# EAGLE schematic slave-basic (EAGLE 8.4.0)
DELETE: MF
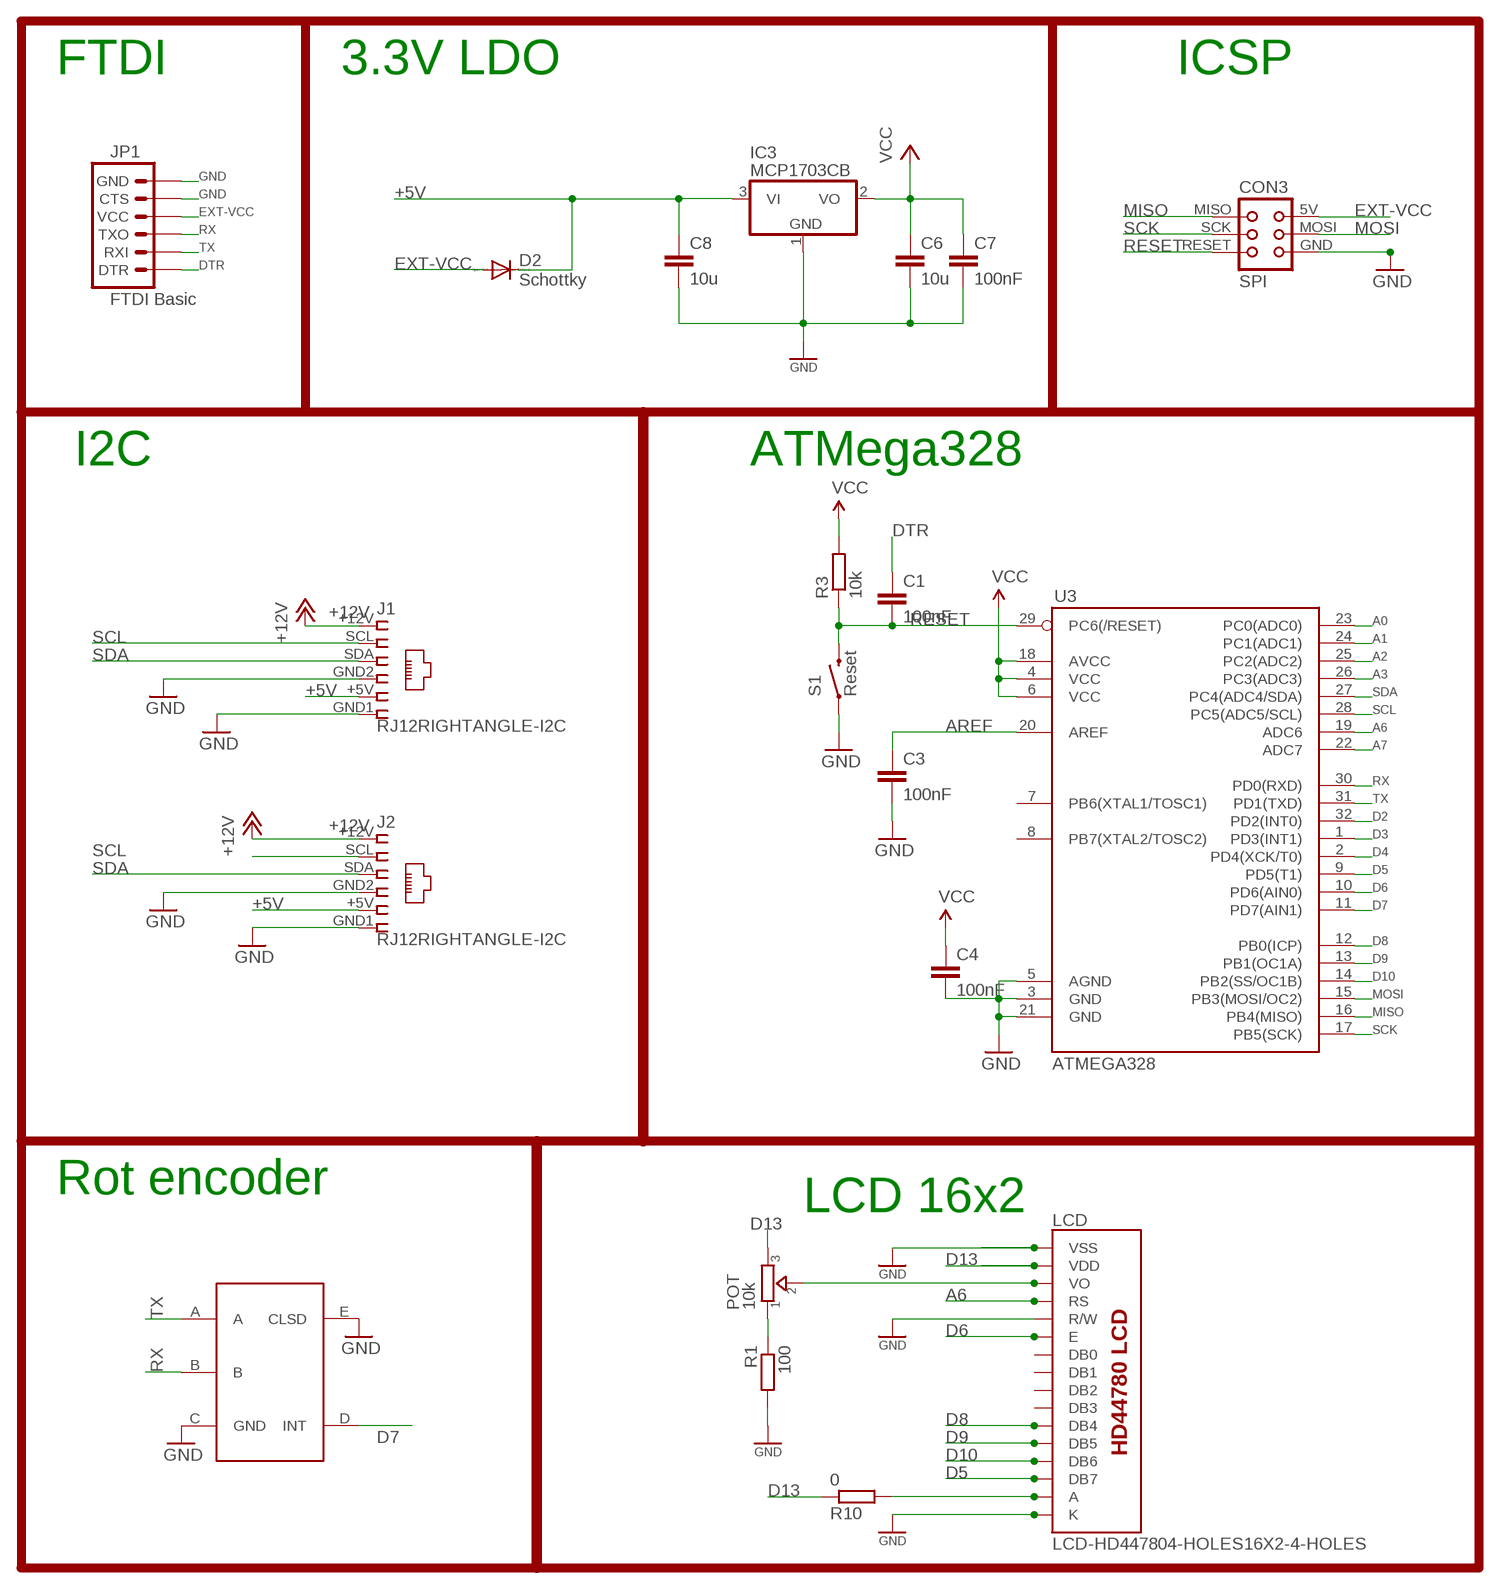
[diagram p0: schematic, sheet 1]

## Parts
C1  100nF  C-EUC0805K  [C0805K]
C3  100nF  C-EUC0805K  [C0805K]
C4  100nF  C-EUC0805K  [C0805K]
C6  10u  C-EUC0805K  [C0805K]
C7  100nF  C-EUC0805K  [C0805K]
C8  10u  C-EUC0805K  [C0805K]
CON3  SPI  TINYISPTAG  [TC2030-MCP]
D2  Schottky  MBR0520LT  [SOD123]
IC3  MCP1703CB  [SOT23]
J1  RJ12RIGHTANGLE-I2C  [RJ12-RIGHTANGLE-I2C]
J2  RJ12RIGHTANGLE-I2C  [RJ12-RIGHTANGLE-I2C]
JP1  FTDI Basic  ARDUINO_SERIAL_PROGRAMPTH  [1X06]
LCD  LCD-HD447804-HOLES16X2-4-HOLES  [LCD-16X2-4HOLES]
POT  10k  TRIMMER-3362P  [TRIMMER_3362P]
R1  100  R-EU_R0805  [R0805]
R3  10k  R-EU_R0805  [R0805]
R10  0  R-EU_R0805  [R0805]
S1  Reset  SWITCH-MOMENTARY-2SMD-ALT01  [TACTILE-SWITCH-SMD-ALT01]
U3  ATMEGA328  ATMEGA168  [TQFP32-08]
U$1  EC11E  [EC11E]

## Nets
+5V: C8.1 D2.C IC3.3(VI) J1.+5V J2.+5V
+12V [power]: J1.+12V J2.+12V
A0: U3.23(PC0(ADC0))
A1: U3.24(PC1(ADC1))
A2: U3.25(PC2(ADC2))
A3: U3.26(PC3(ADC3))
A6: LCD.4(RS) U3.19(ADC6)
A7: U3.22(ADC7)
AREF: C3.1 U3.20(AREF)
D2: U3.32(PD2(INT0))
D3: U3.1(PD3(INT1))
D4: U3.2(PD4(XCK/T0))
D5: LCD.14(DB7) U3.9(PD5(T1))
D6: LCD.6(E) U3.10(PD6(AIN0))
D7: U3.11(PD7(AIN1)) U$1.D(INT)
D8: LCD.11(DB4) U3.12(PB0(ICP))
D9: LCD.12(DB5) U3.13(PB1(OC1A))
D10: LCD.13(DB6) U3.14(PB2(SS/OC1B))
D13: LCD.2(VDD) POT.3 R10.1
DTR: C1.1 JP1.1(DTR)
EXT-VCC: CON3.5V(VCC) D2.A JP1.4(VCC)
GND [power]: C3.2 C4.2 C6.2 C7.2 C8.2 CON3.GND IC3.1(GND) J1.GND1 J1.GND2 J2.GND1 J2.GND2 JP1.5(CTS) JP1.6(GND) LCD.1(VSS) LCD.5(R/W) LCD.16(K) R1.2 S1.1 S1.2 U3.3(GND) U3.5(AGND) U3.21(GND) U$1.C(GND) U$1.E(CLSD)
MISO: CON3.MISO U3.16(PB4(MISO))
MOSI: CON3.MOSI U3.15(PB3(MOSI/OC2))
N$2: LCD.3(VO) POT.2
N$4: POT.1 R1.1
N$11: LCD.15(A) R10.2
RESET: C1.2 CON3.RESET R3.1 S1.3 S1.4 U3.29(PC6(/RESET))
RX: JP1.3(TXO) U3.30(PD0(RXD)) U$1.B
SCK: CON3.SCK U3.17(PB5(SCK))
SCL: J1.SCL J2.SCL U3.28(PC5(ADC5/SCL))
SDA: J1.SDA J2.SDA U3.27(PC4(ADC4/SDA))
TX: JP1.2(RXI) U3.31(PD1(TXD)) U$1.A
VCC: C4.1 C6.1 C7.1 IC3.2(VO) R3.2 U3.4(VCC) U3.6(VCC) U3.18(AVCC)
Unconnected: LCD.7(DB0) LCD.8(DB1) LCD.9(DB2) LCD.10(DB3) U3.7(PB6(XTAL1/TOSC1)) U3.8(PB7(XTAL2/TOSC2))

## Notes on the sheet
- FTDI | 3.3V LDO | ICSP
- I2C | ATMega328
- Rot encoder
- LCD 16x2

## Library data of the parts
C1 C3 C4 C7 = rcl:C-EU: CAPACITOR, European symbol; ELECROW: C49678; LCSC: C49678; MPN: 80-C1206C104K5R
C6 C8 = rcl:C-EU: CAPACITOR, European symbol; ELECROW: C15850; LCSC: C15850; MPN: 77-VJ1206V106ZXQTBC
CON3 = lpatiny:TINYISP: CONNECTOR
D2 = diode:MBR0520LT: SCHOTTKY BARRIER RECTIFIER Source: http://onsemi.com .. MBR0520LT1-D.pdf; LCSC: C82544; MPN: 621-1N5819HW-F
IC3 = linear:MCP1703: 250 mA, 16V, Low Quiescent Current LDO Regulator Source: http://ww1.microchip.com/downloads/en/DeviceDoc/22049b.pdf; LCSC: C53352
J1 J2 = lpatiny:RJ12: CORCOM Modular RJ Jacks No Shield Source: www.tycoelectronics.com .. ENG_DS_1654001_1099_RJ_L_0507.pdf
JP1 = SparkFun:ARDUINO_SERIAL_PROGRAM
LCD = HD44780LCD:LCD-HD44780
POT = dp_devices:TRIMMER: Trimmer resistor
R1 = rcl:R-EU_: RESISTOR, European symbol; ELECROW: C17408; LCSC: C17408
R3 = rcl:R-EU_: RESISTOR, European symbol; ELECROW: C17513; LCSC: C17513
R10 = rcl:R-EU_: RESISTOR, European symbol; ELECROW: C17477; LCSC: C17477
S1 = Testing:SWITCH-MOMENTARY-2: Various NO switches- pushbuttons, reed, etc
U3 = SparkFun:ATMEGA168
U$1 = lpatiny:EC11E: ALPS Rotary encoder

## Net classes
0 default: width 0.406 mm, clearance 0.25 mm
1 power: width 0.406 mm, drill 0.305 mm, clearance 0.25 mm
2 VIN: width 0.406 mm, clearance 0.25 mm
3 fine: width 0.406 mm, clearance 0.25 mm
4 aref: width 0.406 mm, clearance 0.25 mm